# Altium schematic sheet FMC_ADC_100M_10B_16CHA_TDC.SchDoc: FMC_ADC
size 420 x 297 mm; Author: G.Kasprowicz; CompanyName: WUT ISE; DrawnBy: G.Kasprowicz; Organization: WUT ISE; Address1: PW ISE; Address2: Nowowiejska 15/19 00-665 Warsaw; Address3: gkasprow@gmail.com; Revision: 2; SheetNumber: -; SheetTotal: -; ModifiedBy: -; CheckedDate: -; Title2: 100M_10B_16CHA_TDC; DivGrp: WUT ISE; Designer: G.Kasprowicz; ModifiedDate: -; ProjectName: Sensor Box
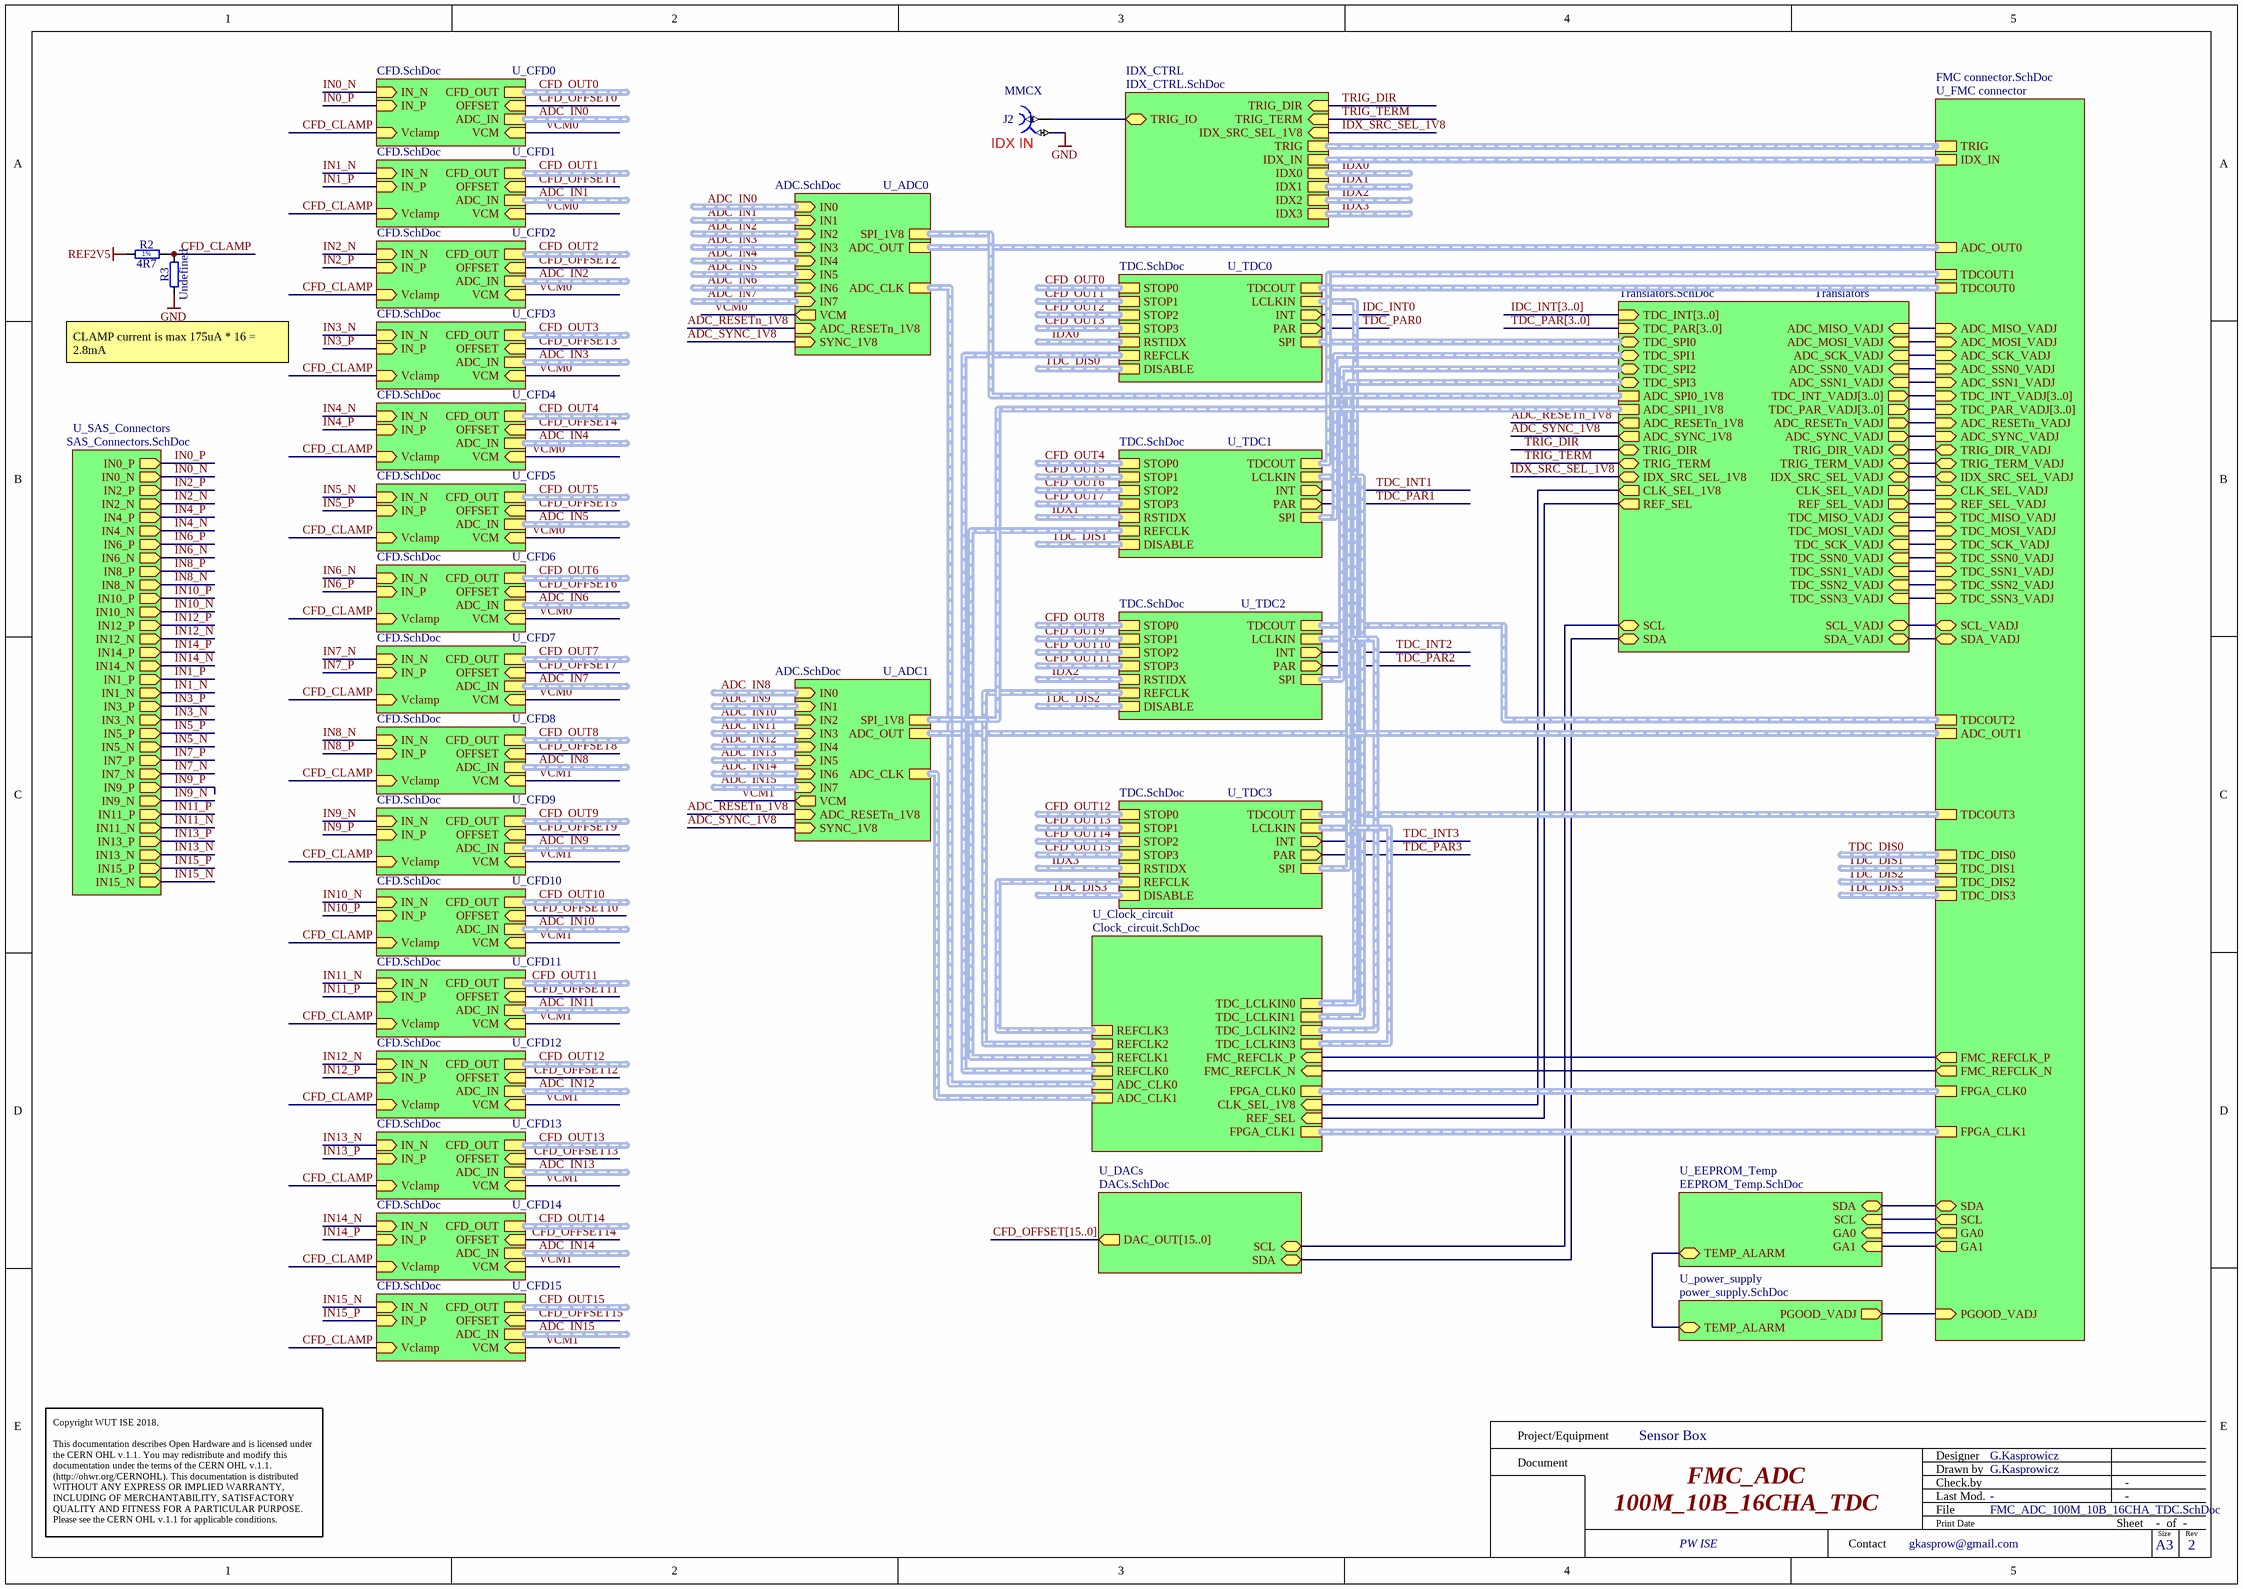
[diagram p0: FMC_ADC_100M_10B_16CHA_TDC.SchDoc]

## Parts
J2  Family: MMCX  [HUBER-SUHNER_85_MMCX-50-0-1/111 OH]  (hidden comment: Coax_1Female_1Shield)
R2  4R7  [RESC1005X40N]
R3  Undefined  [RESC1005X40N]

## Sub-sheets
IDX_CTRL = IDX_CTRL.SchDoc: TRIG_DIR (in), TRIG_TERM (in), IDX1 (harness DIFFSIG), IDX_IN (harness DIFFSIG), IDX2 (harness DIFFSIG), IDX0 (harness DIFFSIG), IDX3 (harness DIFFSIG), TRIG (harness DIFFSIG), TRIG_IO (bidir), IDX_SRC_SEL_1V8 (in)
Translators = Translators.SchDoc: TDC_SPI0 (bidir, harness SPI), TDC_SPI1 (bidir, harness SPI), TDC_SPI2 (bidir, harness SPI), TDC_SPI3 (bidir, harness SPI), ADC_SPI0_1V8 (harness SPI), ADC_SPI1_1V8 (harness SPI), ADC_RESETn_1V8 (out), ADC_SYNC_1V8 (out), TRIG_DIR (bidir), TRIG_TERM (bidir), IDX_SRC_SEL_1V8 (bidir), ADC_RESETn_VADJ (out), ADC_SYNC_VADJ (out), TRIG_DIR_VADJ (bidir), TRIG_TERM_VADJ (bidir), IDX_SRC_SEL_VADJ (bidir), CLK_SEL_1V8 (out), REF_SEL (out), CLK_SEL_VADJ (out), REF_SEL_VADJ (out), ADC_SSN0_VADJ (in), ADC_SSN1_VADJ (in), ADC_MISO_VADJ (in), TDC_MISO_VADJ (in), TDC_MOSI_VADJ (in), TDC_SCK_VADJ (in), TDC_SSN1_VADJ (in), ADC_MOSI_VADJ (in), ADC_SCK_VADJ (in), TDC_SSN0_VADJ (in), TDC_SSN2_VADJ (in), TDC_SSN3_VADJ (in), TDC_INT[3..0] (in), TDC_PAR[3..0] (in), TDC_INT_VADJ[3..0] (out), TDC_PAR_VADJ[3..0] (out), SCL (bidir), SDA (bidir), SCL_VADJ (bidir), SDA_VADJ (bidir)
U_ADC0 = ADC.SchDoc: ADC_OUT (harness ADC_OUT), VCM (out), ADC_CLK (harness DIFFCLK), IN0 (in, harness DIFFSIG), IN5 (in, harness DIFFSIG), IN6 (in, harness DIFFSIG), IN7 (in, harness DIFFSIG), IN4 (in, harness DIFFSIG), IN2 (in, harness DIFFSIG), IN3 (in, harness DIFFSIG), IN1 (in, harness DIFFSIG), ADC_RESETn_1V8 (in), SYNC_1V8 (in), SPI_1V8 (harness SPI)
U_ADC1 = ADC.SchDoc: ADC_OUT (harness ADC_OUT), VCM (out), ADC_CLK (harness DIFFCLK), IN0 (in, harness DIFFSIG), IN5 (in, harness DIFFSIG), IN6 (in, harness DIFFSIG), IN7 (in, harness DIFFSIG), IN4 (in, harness DIFFSIG), IN2 (in, harness DIFFSIG), IN3 (in, harness DIFFSIG), IN1 (in, harness DIFFSIG), ADC_RESETn_1V8 (in), SYNC_1V8 (in), SPI_1V8 (harness SPI)
U_CFD0 = CFD.SchDoc: CFD_OUT (harness DIFFSIG), IN_P (in), OFFSET (in), IN_N (in), VCM (in), Vclamp (in), ADC_IN (harness DIFFSIG)
U_CFD1 = CFD.SchDoc: CFD_OUT (harness DIFFSIG), IN_P (in), OFFSET (in), IN_N (in), VCM (in), Vclamp (in), ADC_IN (harness DIFFSIG)
U_CFD2 = CFD.SchDoc: CFD_OUT (harness DIFFSIG), IN_P (in), OFFSET (in), IN_N (in), VCM (in), Vclamp (in), ADC_IN (harness DIFFSIG)
U_CFD3 = CFD.SchDoc: CFD_OUT (harness DIFFSIG), IN_P (in), OFFSET (in), IN_N (in), VCM (in), Vclamp (in), ADC_IN (harness DIFFSIG)
U_CFD4 = CFD.SchDoc: CFD_OUT (harness DIFFSIG), IN_P (in), OFFSET (in), IN_N (in), VCM (in), Vclamp (in), ADC_IN (harness DIFFSIG)
U_CFD5 = CFD.SchDoc: CFD_OUT (harness DIFFSIG), IN_P (in), OFFSET (in), IN_N (in), VCM (in), Vclamp (in), ADC_IN (harness DIFFSIG)
U_CFD6 = CFD.SchDoc: CFD_OUT (harness DIFFSIG), IN_P (in), OFFSET (in), IN_N (in), VCM (in), Vclamp (in), ADC_IN (harness DIFFSIG)
U_CFD7 = CFD.SchDoc: CFD_OUT (harness DIFFSIG), IN_P (in), OFFSET (in), IN_N (in), VCM (in), Vclamp (in), ADC_IN (harness DIFFSIG)
U_CFD8 = CFD.SchDoc: CFD_OUT (harness DIFFSIG), IN_P (in), OFFSET (in), IN_N (in), VCM (in), Vclamp (in), ADC_IN (harness DIFFSIG)
U_CFD9 = CFD.SchDoc: CFD_OUT (harness DIFFSIG), IN_P (in), OFFSET (in), IN_N (in), VCM (in), Vclamp (in), ADC_IN (harness DIFFSIG)
U_CFD10 = CFD.SchDoc: CFD_OUT (harness DIFFSIG), IN_P (in), OFFSET (in), IN_N (in), VCM (in), Vclamp (in), ADC_IN (harness DIFFSIG)
U_CFD11 = CFD.SchDoc: CFD_OUT (harness DIFFSIG), IN_P (in), OFFSET (in), IN_N (in), VCM (in), Vclamp (in), ADC_IN (harness DIFFSIG)
U_CFD12 = CFD.SchDoc: CFD_OUT (harness DIFFSIG), IN_P (in), OFFSET (in), IN_N (in), VCM (in), Vclamp (in), ADC_IN (harness DIFFSIG)
U_CFD13 = CFD.SchDoc: CFD_OUT (harness DIFFSIG), IN_P (in), OFFSET (in), IN_N (in), VCM (in), Vclamp (in), ADC_IN (harness DIFFSIG)
U_CFD14 = CFD.SchDoc: CFD_OUT (harness DIFFSIG), IN_P (in), OFFSET (in), IN_N (in), VCM (in), Vclamp (in), ADC_IN (harness DIFFSIG)
U_CFD15 = CFD.SchDoc: CFD_OUT (harness DIFFSIG), IN_P (in), OFFSET (in), IN_N (in), VCM (in), Vclamp (in), ADC_IN (harness DIFFSIG)
U_Clock_circuit = Clock_circuit.SchDoc: FMC_REFCLK_P (in), FMC_REFCLK_N (in), TDC_LCLKIN0 (harness DIFFCLK), TDC_LCLKIN1 (harness DIFFCLK), TDC_LCLKIN2 (harness DIFFCLK), TDC_LCLKIN3 (harness DIFFCLK), ADC_CLK0 (harness DIFFCLK), ADC_CLK1 (harness DIFFCLK), REFCLK0 (harness DIFFCLK), REFCLK1 (harness DIFFCLK), REFCLK2 (harness DIFFCLK), REFCLK3 (harness DIFFCLK), FPGA_CLK0 (harness DIFFCLK), CLK_SEL_1V8 (in), REF_SEL (in), FPGA_CLK1 (harness DIFFCLK)
U_DACs = DACs.SchDoc: SDA (bidir), SCL (bidir), DAC_OUT[15..0] (out)
U_EEPROM_Temp = EEPROM_Temp.SchDoc: SDA (bidir), SCL (in), GA0 (in), GA1 (in), TEMP_ALARM (bidir)
U_FMC connector = FMC connector.SchDoc: SDA (bidir), GA1 (out), GA0 (out), SCL (out), FMC_REFCLK_P (out), FMC_REFCLK_N (out), TDCOUT0 (harness TDCOUT), TDCOUT1 (harness TDCOUT), TDCOUT2 (harness TDCOUT), TDCOUT3 (harness TDCOUT), ADC_OUT0 (harness ADC_OUT), ADC_OUT1 (harness ADC_OUT), TRIG (harness DIFFSIG), IDX_IN (harness DIFFSIG), FPGA_CLK0 (harness DIFFCLK), FPGA_CLK1 (harness DIFFCLK), ADC_RESETn_VADJ (in), ADC_SYNC_VADJ (in), TRIG_DIR_VADJ (bidir), TRIG_TERM_VADJ (bidir), IDX_SRC_SEL_VADJ (bidir), CLK_SEL_VADJ (in), REF_SEL_VADJ (in), PGOOD_VADJ (in), ADC_MISO_VADJ (in), ADC_MOSI_VADJ (in), ADC_SCK_VADJ (in), ADC_SSN0_VADJ (in), ADC_SSN1_VADJ (in), TDC_MISO_VADJ (in), TDC_MOSI_VADJ (in), TDC_SCK_VADJ (in), TDC_SSN0_VADJ (in), TDC_SSN1_VADJ (in), TDC_SSN2_VADJ (in), TDC_SSN3_VADJ (in), TDC_DIS0 (harness DIFFSIG), TDC_DIS1 (harness DIFFSIG), TDC_DIS2 (harness DIFFSIG), TDC_DIS3 (harness DIFFSIG), TDC_INT_VADJ[3..0] (in), TDC_PAR_VADJ[3..0] (in), SCL_VADJ (bidir), SDA_VADJ (bidir)
U_power_supply = power_supply.SchDoc: PGOOD_VADJ (out), TEMP_ALARM (bidir)
U_SAS_Connectors = SAS_Connectors.SchDoc: IN0_P (out), IN0_N (out), IN2_P (out), IN2_N (out), IN4_P (out), IN4_N (out), IN6_P (out), IN6_N (out), IN8_P (out), IN8_N (out), IN10_P (out), IN10_N (out), IN12_P (out), IN12_N (out), IN14_P (out), IN14_N (out), IN1_P (out), IN1_N (out), IN3_P (out), IN3_N (out), IN5_P (out), IN5_N (out), IN7_P (out), IN7_N (out), IN9_P (out), IN9_N (out), IN11_P (out), IN11_N (out), IN13_P (out), IN13_N (out), IN15_P (out), IN15_N (out)
U_TDC0 = TDC.SchDoc: LCLKIN (harness DIFFCLK), DISABLE (harness DIFFSIG), REFCLK (harness DIFFCLK), SPI (harness SPI), STOP1 (harness DIFFSIG), INT (out), RSTIDX (harness DIFFSIG), STOP3 (harness DIFFSIG), TDCOUT (harness TDCOUT), PAR (out), STOP0 (harness DIFFSIG), STOP2 (harness DIFFSIG)
U_TDC1 = TDC.SchDoc: LCLKIN (harness DIFFCLK), DISABLE (harness DIFFSIG), REFCLK (harness DIFFCLK), SPI (harness SPI), INT (out), RSTIDX (harness DIFFSIG), TDCOUT (harness TDCOUT), PAR (out), STOP1 (harness DIFFSIG), STOP3 (harness DIFFSIG), STOP0 (harness DIFFSIG), STOP2 (harness DIFFSIG)
U_TDC2 = TDC.SchDoc: LCLKIN (harness DIFFCLK), DISABLE (harness DIFFSIG), REFCLK (harness DIFFCLK), SPI (harness SPI), INT (out), RSTIDX (harness DIFFSIG), TDCOUT (harness TDCOUT), PAR (out), STOP1 (harness DIFFSIG), STOP3 (harness DIFFSIG), STOP0 (harness DIFFSIG), STOP2 (harness DIFFSIG)
U_TDC3 = TDC.SchDoc: LCLKIN (harness DIFFCLK), DISABLE (harness DIFFSIG), REFCLK (harness DIFFCLK), SPI (harness SPI), INT (out), RSTIDX (harness DIFFSIG), TDCOUT (harness TDCOUT), PAR (out), STOP1 (harness DIFFSIG), STOP3 (harness DIFFSIG), STOP0 (harness DIFFSIG), STOP2 (harness DIFFSIG)

## Nets
GND: J2.2 R3.1
REF2V5: R2.1
ADC_RESETn_1V8: sheet U_ADC0/ADC_RESETn_1V8, sheet U_ADC1/ADC_RESETn_1V8, sheet Translators/ADC_RESETn_1V8
ADC_SYNC_1V8: sheet U_ADC0/SYNC_1V8, sheet U_ADC1/SYNC_1V8, sheet Translators/ADC_SYNC_1V8
CFD_CLAMP: R2.2 R3.2 ; sheet U_CFD0/Vclamp, sheet U_CFD1/Vclamp, sheet U_CFD2/Vclamp, sheet U_CFD3/Vclamp, sheet U_CFD4/Vclamp, sheet U_CFD5/Vclamp, sheet U_CFD6/Vclamp, sheet U_CFD7/Vclamp, sheet U_CFD8/Vclamp, sheet U_CFD9/Vclamp, sheet U_CFD10/Vclamp, sheet U_CFD11/Vclamp, sheet U_CFD12/Vclamp, sheet U_CFD13/Vclamp, sheet U_CFD14/Vclamp, sheet U_CFD15/Vclamp
CFD_OFFSET0: sheet U_CFD0/OFFSET
CFD_OFFSET1: sheet U_CFD1/OFFSET
CFD_OFFSET2: sheet U_CFD2/OFFSET
CFD_OFFSET3: sheet U_CFD3/OFFSET
CFD_OFFSET4: sheet U_CFD4/OFFSET
CFD_OFFSET5: sheet U_CFD5/OFFSET
CFD_OFFSET6: sheet U_CFD6/OFFSET
CFD_OFFSET7: sheet U_CFD7/OFFSET
CFD_OFFSET8: sheet U_CFD8/OFFSET
CFD_OFFSET9: sheet U_CFD9/OFFSET
CFD_OFFSET10: sheet U_CFD10/OFFSET
CFD_OFFSET11: sheet U_CFD11/OFFSET
CFD_OFFSET12: sheet U_CFD12/OFFSET
CFD_OFFSET13: sheet U_CFD13/OFFSET
CFD_OFFSET14: sheet U_CFD14/OFFSET
CFD_OFFSET15: sheet U_CFD15/OFFSET
IDC_INT0: sheet U_TDC0/INT
IDX_SRC_SEL_1V8: sheet IDX_CTRL/IDX_SRC_SEL_1V8, sheet Translators/IDX_SRC_SEL_1V8
IN0_N: sheet U_CFD0/IN_N, sheet U_SAS_Connectors/IN0_N
IN0_P: sheet U_CFD0/IN_P, sheet U_SAS_Connectors/IN0_P
IN1_N: sheet U_CFD1/IN_N, sheet U_SAS_Connectors/IN1_N
IN1_P: sheet U_CFD1/IN_P, sheet U_SAS_Connectors/IN1_P
IN2_N: sheet U_CFD2/IN_N, sheet U_SAS_Connectors/IN2_N
IN2_P: sheet U_CFD2/IN_P, sheet U_SAS_Connectors/IN2_P
IN3_N: sheet U_CFD3/IN_N, sheet U_SAS_Connectors/IN3_N
IN3_P: sheet U_CFD3/IN_P, sheet U_SAS_Connectors/IN3_P
IN4_N: sheet U_CFD4/IN_N, sheet U_SAS_Connectors/IN4_N
IN4_P: sheet U_CFD4/IN_P, sheet U_SAS_Connectors/IN4_P
IN5_N: sheet U_CFD5/IN_N, sheet U_SAS_Connectors/IN5_N
IN5_P: sheet U_CFD5/IN_P, sheet U_SAS_Connectors/IN5_P
IN6_N: sheet U_CFD6/IN_N, sheet U_SAS_Connectors/IN6_N
IN6_P: sheet U_CFD6/IN_P, sheet U_SAS_Connectors/IN6_P
IN7_N: sheet U_CFD7/IN_N, sheet U_SAS_Connectors/IN7_N
IN7_P: sheet U_CFD7/IN_P, sheet U_SAS_Connectors/IN7_P
IN8_N: sheet U_CFD8/IN_N, sheet U_SAS_Connectors/IN8_N
IN8_P: sheet U_CFD8/IN_P, sheet U_SAS_Connectors/IN8_P
IN9_N: sheet U_CFD9/IN_N, sheet U_SAS_Connectors/IN9_N
IN9_P: sheet U_CFD9/IN_P, sheet U_SAS_Connectors/IN9_P
IN10_N: sheet U_CFD10/IN_N, sheet U_SAS_Connectors/IN10_N
IN10_P: sheet U_CFD10/IN_P, sheet U_SAS_Connectors/IN10_P
IN11_N: sheet U_CFD11/IN_N, sheet U_SAS_Connectors/IN11_N
IN11_P: sheet U_CFD11/IN_P, sheet U_SAS_Connectors/IN11_P
IN12_N: sheet U_CFD12/IN_N, sheet U_SAS_Connectors/IN12_N
IN12_P: sheet U_CFD12/IN_P, sheet U_SAS_Connectors/IN12_P
IN13_N: sheet U_CFD13/IN_N, sheet U_SAS_Connectors/IN13_N
IN13_P: sheet U_CFD13/IN_P, sheet U_SAS_Connectors/IN13_P
IN14_N: sheet U_CFD14/IN_N, sheet U_SAS_Connectors/IN14_N
IN14_P: sheet U_CFD14/IN_P, sheet U_SAS_Connectors/IN14_P
IN15_N: sheet U_CFD15/IN_N, sheet U_SAS_Connectors/IN15_N
IN15_P: sheet U_CFD15/IN_P, sheet U_SAS_Connectors/IN15_P
TDC_INT1: sheet U_TDC1/INT
TDC_INT2: sheet U_TDC2/INT
TDC_INT3: sheet U_TDC3/INT
TDC_PAR0: sheet U_TDC0/PAR
TDC_PAR1: sheet U_TDC1/PAR
TDC_PAR2: sheet U_TDC2/PAR
TDC_PAR3: sheet U_TDC3/PAR
TRIG_DIR: sheet IDX_CTRL/TRIG_DIR, sheet Translators/TRIG_DIR
TRIG_TERM: sheet IDX_CTRL/TRIG_TERM, sheet Translators/TRIG_TERM
VCM0: sheet U_ADC0/VCM, sheet U_CFD0/VCM, sheet U_CFD1/VCM, sheet U_CFD2/VCM, sheet U_CFD3/VCM, sheet U_CFD4/VCM, sheet U_CFD5/VCM, sheet U_CFD6/VCM, sheet U_CFD7/VCM
VCM1: sheet U_CFD8/VCM, sheet U_CFD9/VCM, sheet U_CFD10/VCM, sheet U_CFD11/VCM, sheet U_CFD12/VCM, sheet U_CFD13/VCM, sheet U_CFD14/VCM, sheet U_CFD15/VCM, sheet U_ADC1/VCM
NetJ2_1: J2.1 ; sheet IDX_CTRL/TRIG_IO
(unnamed): sheet U_Clock_circuit/FMC_REFCLK_P, sheet U_FMC connector/FMC_REFCLK_P
(unnamed): sheet U_Clock_circuit/FMC_REFCLK_N, sheet U_FMC connector/FMC_REFCLK_N
(unnamed): sheet U_Clock_circuit/CLK_SEL_1V8, sheet Translators/CLK_SEL_1V8
(unnamed): sheet U_Clock_circuit/REF_SEL, sheet Translators/REF_SEL
(unnamed): sheet U_EEPROM_Temp/SDA, sheet U_FMC connector/SDA
(unnamed): sheet U_EEPROM_Temp/SCL, sheet U_FMC connector/SCL
(unnamed): sheet U_EEPROM_Temp/GA0, sheet U_FMC connector/GA0
(unnamed): sheet U_EEPROM_Temp/GA1, sheet U_FMC connector/GA1
(unnamed): sheet U_EEPROM_Temp/TEMP_ALARM, sheet U_power_supply/TEMP_ALARM
(unnamed): sheet U_FMC connector/ADC_RESETn_VADJ, sheet Translators/ADC_RESETn_VADJ
(unnamed): sheet U_FMC connector/ADC_SYNC_VADJ, sheet Translators/ADC_SYNC_VADJ
(unnamed): sheet U_FMC connector/TRIG_DIR_VADJ, sheet Translators/TRIG_DIR_VADJ
(unnamed): sheet U_FMC connector/TRIG_TERM_VADJ, sheet Translators/TRIG_TERM_VADJ
(unnamed): sheet U_FMC connector/IDX_SRC_SEL_VADJ, sheet Translators/IDX_SRC_SEL_VADJ
(unnamed): sheet U_FMC connector/CLK_SEL_VADJ, sheet Translators/CLK_SEL_VADJ
(unnamed): sheet U_FMC connector/REF_SEL_VADJ, sheet Translators/REF_SEL_VADJ
(unnamed): sheet U_FMC connector/PGOOD_VADJ, sheet U_power_supply/PGOOD_VADJ
(unnamed): sheet U_FMC connector/ADC_MISO_VADJ, sheet Translators/ADC_MISO_VADJ
(unnamed): sheet U_FMC connector/ADC_MOSI_VADJ, sheet Translators/ADC_MOSI_VADJ
(unnamed): sheet U_FMC connector/ADC_SCK_VADJ, sheet Translators/ADC_SCK_VADJ
(unnamed): sheet U_FMC connector/ADC_SSN0_VADJ, sheet Translators/ADC_SSN0_VADJ
(unnamed): sheet U_FMC connector/ADC_SSN1_VADJ, sheet Translators/ADC_SSN1_VADJ
(unnamed): sheet U_FMC connector/TDC_MISO_VADJ, sheet Translators/TDC_MISO_VADJ
(unnamed): sheet U_FMC connector/TDC_MOSI_VADJ, sheet Translators/TDC_MOSI_VADJ
(unnamed): sheet U_FMC connector/TDC_SCK_VADJ, sheet Translators/TDC_SCK_VADJ
(unnamed): sheet U_FMC connector/TDC_SSN0_VADJ, sheet Translators/TDC_SSN0_VADJ
(unnamed): sheet U_FMC connector/TDC_SSN1_VADJ, sheet Translators/TDC_SSN1_VADJ
(unnamed): sheet U_FMC connector/TDC_SSN2_VADJ, sheet Translators/TDC_SSN2_VADJ
(unnamed): sheet U_FMC connector/TDC_SSN3_VADJ, sheet Translators/TDC_SSN3_VADJ
(unnamed): sheet U_FMC connector/SCL_VADJ, sheet Translators/SCL_VADJ
(unnamed): sheet U_FMC connector/SDA_VADJ, sheet Translators/SDA_VADJ
(unnamed): sheet U_DACs/SDA, sheet Translators/SDA
(unnamed): sheet U_DACs/SCL, sheet Translators/SCL

## Buses and harness runs
bus CFD_OFFSET[15..0] = sheet U_DACs/DAC_OUT[15..0]
bus IDC_INT[3..0] = sheet Translators/TDC_INT[3..0]
bus sheet Translators/TDC_INT_VADJ[3..0] = sheet U_FMC connector/TDC_INT_VADJ[3..0]
bus sheet Translators/TDC_PAR_VADJ[3..0] = sheet U_FMC connector/TDC_PAR_VADJ[3..0]
bus TDC_PAR[3..0] = sheet Translators/TDC_PAR[3..0]
harness ADC_IN0 = sheet U_ADC0/IN0
harness ADC_IN0 = sheet U_CFD0/ADC_IN
harness ADC_IN1 = sheet U_ADC0/IN1
harness ADC_IN1 = sheet U_CFD1/ADC_IN
harness ADC_IN2 = sheet U_ADC0/IN2
harness ADC_IN2 = sheet U_CFD2/ADC_IN
harness ADC_IN3 = sheet U_ADC0/IN3
harness ADC_IN3 = sheet U_CFD3/ADC_IN
harness ADC_IN4 = sheet U_ADC0/IN4
harness ADC_IN4 = sheet U_CFD4/ADC_IN
harness ADC_IN5 = sheet U_ADC0/IN5
harness ADC_IN5 = sheet U_CFD5/ADC_IN
harness ADC_IN6 = sheet U_ADC0/IN6
harness ADC_IN6 = sheet U_CFD6/ADC_IN
harness ADC_IN7 = sheet U_ADC0/IN7
harness ADC_IN7 = sheet U_CFD7/ADC_IN
harness ADC_IN8 = sheet U_ADC1/IN0
harness ADC_IN8 = sheet U_CFD8/ADC_IN
harness ADC_IN9 = sheet U_ADC1/IN1
harness ADC_IN9 = sheet U_CFD9/ADC_IN
harness ADC_IN10 = sheet U_ADC1/IN2
harness ADC_IN10 = sheet U_CFD10/ADC_IN
harness ADC_IN11 = sheet U_ADC1/IN3
harness ADC_IN11 = sheet U_CFD11/ADC_IN
harness ADC_IN12 = sheet U_ADC1/IN4
harness ADC_IN12 = sheet U_CFD12/ADC_IN
harness ADC_IN13 = sheet U_ADC1/IN5
harness ADC_IN13 = sheet U_CFD13/ADC_IN
harness ADC_IN14 = sheet U_ADC1/IN6
harness ADC_IN14 = sheet U_CFD14/ADC_IN
harness ADC_IN15 = sheet U_ADC1/IN7
harness ADC_IN15 = sheet U_CFD15/ADC_IN
harness CFD_OUT0 = sheet U_CFD0/CFD_OUT
harness CFD_OUT0 = sheet U_TDC0/STOP0
harness CFD_OUT1 = sheet U_CFD1/CFD_OUT
harness CFD_OUT1 = sheet U_TDC0/STOP1
harness CFD_OUT2 = sheet U_CFD2/CFD_OUT
harness CFD_OUT2 = sheet U_TDC0/STOP2
harness CFD_OUT3 = sheet U_CFD3/CFD_OUT
harness CFD_OUT3 = sheet U_TDC0/STOP3
harness CFD_OUT4 = sheet U_CFD4/CFD_OUT
harness CFD_OUT4 = sheet U_TDC1/STOP0
harness CFD_OUT5 = sheet U_CFD5/CFD_OUT
harness CFD_OUT5 = sheet U_TDC1/STOP1
harness CFD_OUT6 = sheet U_CFD6/CFD_OUT
harness CFD_OUT6 = sheet U_TDC1/STOP2
harness CFD_OUT7 = sheet U_CFD7/CFD_OUT
harness CFD_OUT7 = sheet U_TDC1/STOP3
harness CFD_OUT8 = sheet U_CFD8/CFD_OUT
harness CFD_OUT8 = sheet U_TDC2/STOP0
harness CFD_OUT9 = sheet U_CFD9/CFD_OUT
harness CFD_OUT9 = sheet U_TDC2/STOP1
harness CFD_OUT10 = sheet U_CFD10/CFD_OUT
harness CFD_OUT10 = sheet U_TDC2/STOP2
harness CFD_OUT11 = sheet U_CFD11/CFD_OUT
harness CFD_OUT11 = sheet U_TDC2/STOP3
harness CFD_OUT12 = sheet U_CFD12/CFD_OUT
harness CFD_OUT12 = sheet U_TDC3/STOP0
harness CFD_OUT13 = sheet U_CFD13/CFD_OUT
harness CFD_OUT13 = sheet U_TDC3/STOP1
harness CFD_OUT14 = sheet U_CFD14/CFD_OUT
harness CFD_OUT14 = sheet U_TDC3/STOP2
harness CFD_OUT15 = sheet U_CFD15/CFD_OUT
harness CFD_OUT15 = sheet U_TDC3/STOP3
harness IDX0 = sheet IDX_CTRL/IDX0
harness IDX0 = sheet U_TDC0/RSTIDX
harness IDX1 = sheet IDX_CTRL/IDX1
harness IDX1 = sheet U_TDC1/RSTIDX
harness IDX2 = sheet IDX_CTRL/IDX2
harness IDX2 = sheet U_TDC2/RSTIDX
harness IDX3 = sheet IDX_CTRL/IDX3
harness IDX3 = sheet U_TDC3/RSTIDX
harness sheet IDX_CTRL/IDX_IN = sheet U_FMC connector/IDX_IN
harness sheet IDX_CTRL/TRIG = sheet U_FMC connector/TRIG
harness sheet Translators/ADC_SPI0_1V8 = sheet U_ADC0/SPI_1V8
harness sheet Translators/ADC_SPI1_1V8 = sheet U_ADC1/SPI_1V8
harness sheet Translators/TDC_SPI0 = sheet U_TDC0/SPI
harness sheet Translators/TDC_SPI1 = sheet U_TDC1/SPI
harness sheet Translators/TDC_SPI2 = sheet U_TDC2/SPI
harness sheet Translators/TDC_SPI3 = sheet U_TDC3/SPI
harness sheet U_ADC0/ADC_CLK = sheet U_Clock_circuit/ADC_CLK0
harness sheet U_ADC0/ADC_OUT = sheet U_FMC connector/ADC_OUT0
harness sheet U_ADC1/ADC_CLK = sheet U_Clock_circuit/ADC_CLK1
harness sheet U_ADC1/ADC_OUT = sheet U_FMC connector/ADC_OUT1
harness sheet U_Clock_circuit/FPGA_CLK0 = sheet U_FMC connector/FPGA_CLK0
harness sheet U_Clock_circuit/FPGA_CLK1 = sheet U_FMC connector/FPGA_CLK1
harness sheet U_Clock_circuit/REFCLK0 = sheet U_TDC0/REFCLK
harness sheet U_Clock_circuit/REFCLK1 = sheet U_TDC1/REFCLK
harness sheet U_Clock_circuit/REFCLK2 = sheet U_TDC2/REFCLK
harness sheet U_Clock_circuit/REFCLK3 = sheet U_TDC3/REFCLK
harness sheet U_Clock_circuit/TDC_LCLKIN0 = sheet U_TDC0/LCLKIN
harness sheet U_Clock_circuit/TDC_LCLKIN1 = sheet U_TDC1/LCLKIN
harness sheet U_Clock_circuit/TDC_LCLKIN2 = sheet U_TDC2/LCLKIN
harness sheet U_Clock_circuit/TDC_LCLKIN3 = sheet U_TDC3/LCLKIN
harness sheet U_FMC connector/TDCOUT0 = sheet U_TDC0/TDCOUT
harness sheet U_FMC connector/TDCOUT1 = sheet U_TDC1/TDCOUT
harness sheet U_FMC connector/TDCOUT2 = sheet U_TDC2/TDCOUT
harness sheet U_FMC connector/TDCOUT3 = sheet U_TDC3/TDCOUT
harness TDC_DIS0 = sheet U_FMC connector/TDC_DIS0
harness TDC_DIS0 = sheet U_TDC0/DISABLE
harness TDC_DIS1 = sheet U_FMC connector/TDC_DIS1
harness TDC_DIS1 = sheet U_TDC1/DISABLE
harness TDC_DIS2 = sheet U_FMC connector/TDC_DIS2
harness TDC_DIS2 = sheet U_TDC2/DISABLE
harness TDC_DIS3 = sheet U_FMC connector/TDC_DIS3
harness TDC_DIS3 = sheet U_TDC3/DISABLE

## Notes on the sheet
- (near J2) IDX IN
- (near R3) CLAMP current is max 175uA * 16 = 2.8mA
- Project/Equipment
- Document
- Designer
- Drawn by
- Check.by
- Copyright WUT ISE 2018.
  This documentation describes Open Hardware and is licensed under the CERN OHL v.1.1. You may redistribute and modify this documentation under the terms of the CERN OHL v.1.1. (http://ohwr.org/CERNOHL). This documentation is distributed WITHOUT ANY EXPRESS OR IMPLIED WARRANTY, INCLUDING OF MERCHANTABILITY, SATISFACTORY QUALITY AND FITNESS FOR A PARTICULAR PURPOSE. Please see the CERN OHL v.1.1 for applicable conditions.
- Contact
- File
- Last Mod.
- Print Date
- Sheet
- Size
- A3
- of
- Rev
- (in symbol R0402_4R7_1%_0.0625W_200PPM) 1%

## Library data of the parts
J2 = HUBER-SUHNER_85_MMCX-50-0-1/111 OH: Part Description: MMCX 50 Ohms Right Angle PCB Jack; Manufacturer: HUBER+SUHNER; Table: Miscellaneous; Part Number: HUBER-SUHNER_85_MMCX-50-0-1/111 OH; Component Kind: Standard; Component Type: Standard; Pin Count: 2; Mounted: Yes; Socket: No; SMD: No; Status: None; Manufacturer Part Number: 85_MMCX-50-0-1/111 OH; ComponentHeight: 9.6mm; HelpURL: \\cern.ch\dfs\Applications\Altium\Datasheets\HUBER-SUHNER_85_MMCX-50-0-1-111 OH.pdf; Author: CERN DEM JLC; CreateDate: 2011-10-04; LatestRevisionDate: 2011-10-04
R2 = R0402_4R7_1%_0.0625W_200PPM: Resistor - 1%; Part Description: General Purpose Thick Film Chip Resistor; Manufacturer: GENERIC; Manufacturer1 Part Number: 232270674708L; TC: ±200ppm/°C; PressFit: No; Part Number: R0402_4R7_1%_0.0625W_200PPM; Component Kind: Standard; Component Type: Standard; Pin Count: 2; Value: 4R7; Status: Not Recommended; Power: 0.0625W; Tolerance: ±1%; Manufacturer Part Number: R0402_4R7_1%_0.0625W_200PPM; Case: 0402; Mounted: Yes; Sense: No; Socket: No; SMD: Yes; Manufacturer1 Example: YAGEO PHYCOMP; Manufacturer1 ComponentHeight: 0.4mm; HelpURL: \\cern.ch\dfs\Applications\Altium\Datasheets\R0402_Phycomp_RC0402.pdf; Author: CERN DEM JLC; CreateDate: 03.12.2007; LatestRevisionDate: 17.10.2012
R3 = R0402_NO-VALUE: Resistor; Part Description: Reserved Footprint For a 0402 (1005) Chip Resistor; PressFit: No; Mounted: No; Part Number: R0402_NO-VALUE; Component Kind: Standard; Component Type: Standard; Pin Count: 2; Value: Undefined; Status: None; Manufacturer: Undefined; Manufacturer Part Number: R0402_NO-VALUE; Case: 0402; Sense: No; Socket: No; SMD: Yes; Manufacturer1 Example: Undefined; Manufacturer1 Part Number: Undefined; Manufacturer1 ComponentHeight: Undefined; HelpURL: Undefined; Author: CERN DEM JLC; CreateDate: 03.12.2007; LatestRevisionDate: 13.03.2008